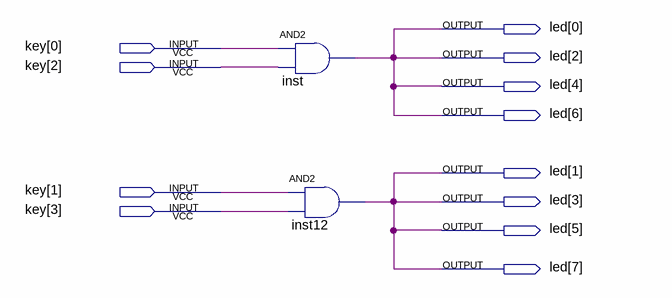
[diagram p0: schematic sheet]
// Quartus schematic Test_EPM240.bdf as structural Verilog: 2 symbols, 12 pins
module Test_EPM240 (
  input  [3:0] key,
  output [7:0] led
);

  and inst (led[6], key[0], key[2]);
  and inst12 (led[7], key[1], key[3]);

  assign led[5:0] = {led[7:6], led[7:6], led[7:6]};
endmodule
